# Altium schematic sheet Schematic.SchDoc
size A4
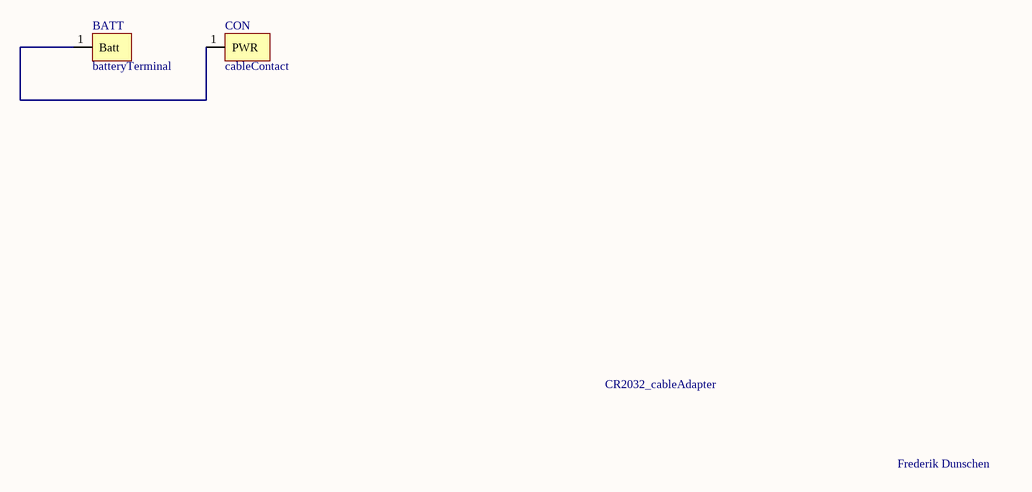
[diagram p0: Schematic.SchDoc]

## Parts
BATT  batteryTerminal  [PCBComponent_1]
CON  cableContact  [CABLECONTQACT]

## Nets
NetBATT_1: BATT.1(Batt) CON.1(PWR)

## Notes on the sheet
- CR2032_cableAdapter
- Frederik Dunschen